# Altium project bai2.PrjPcb
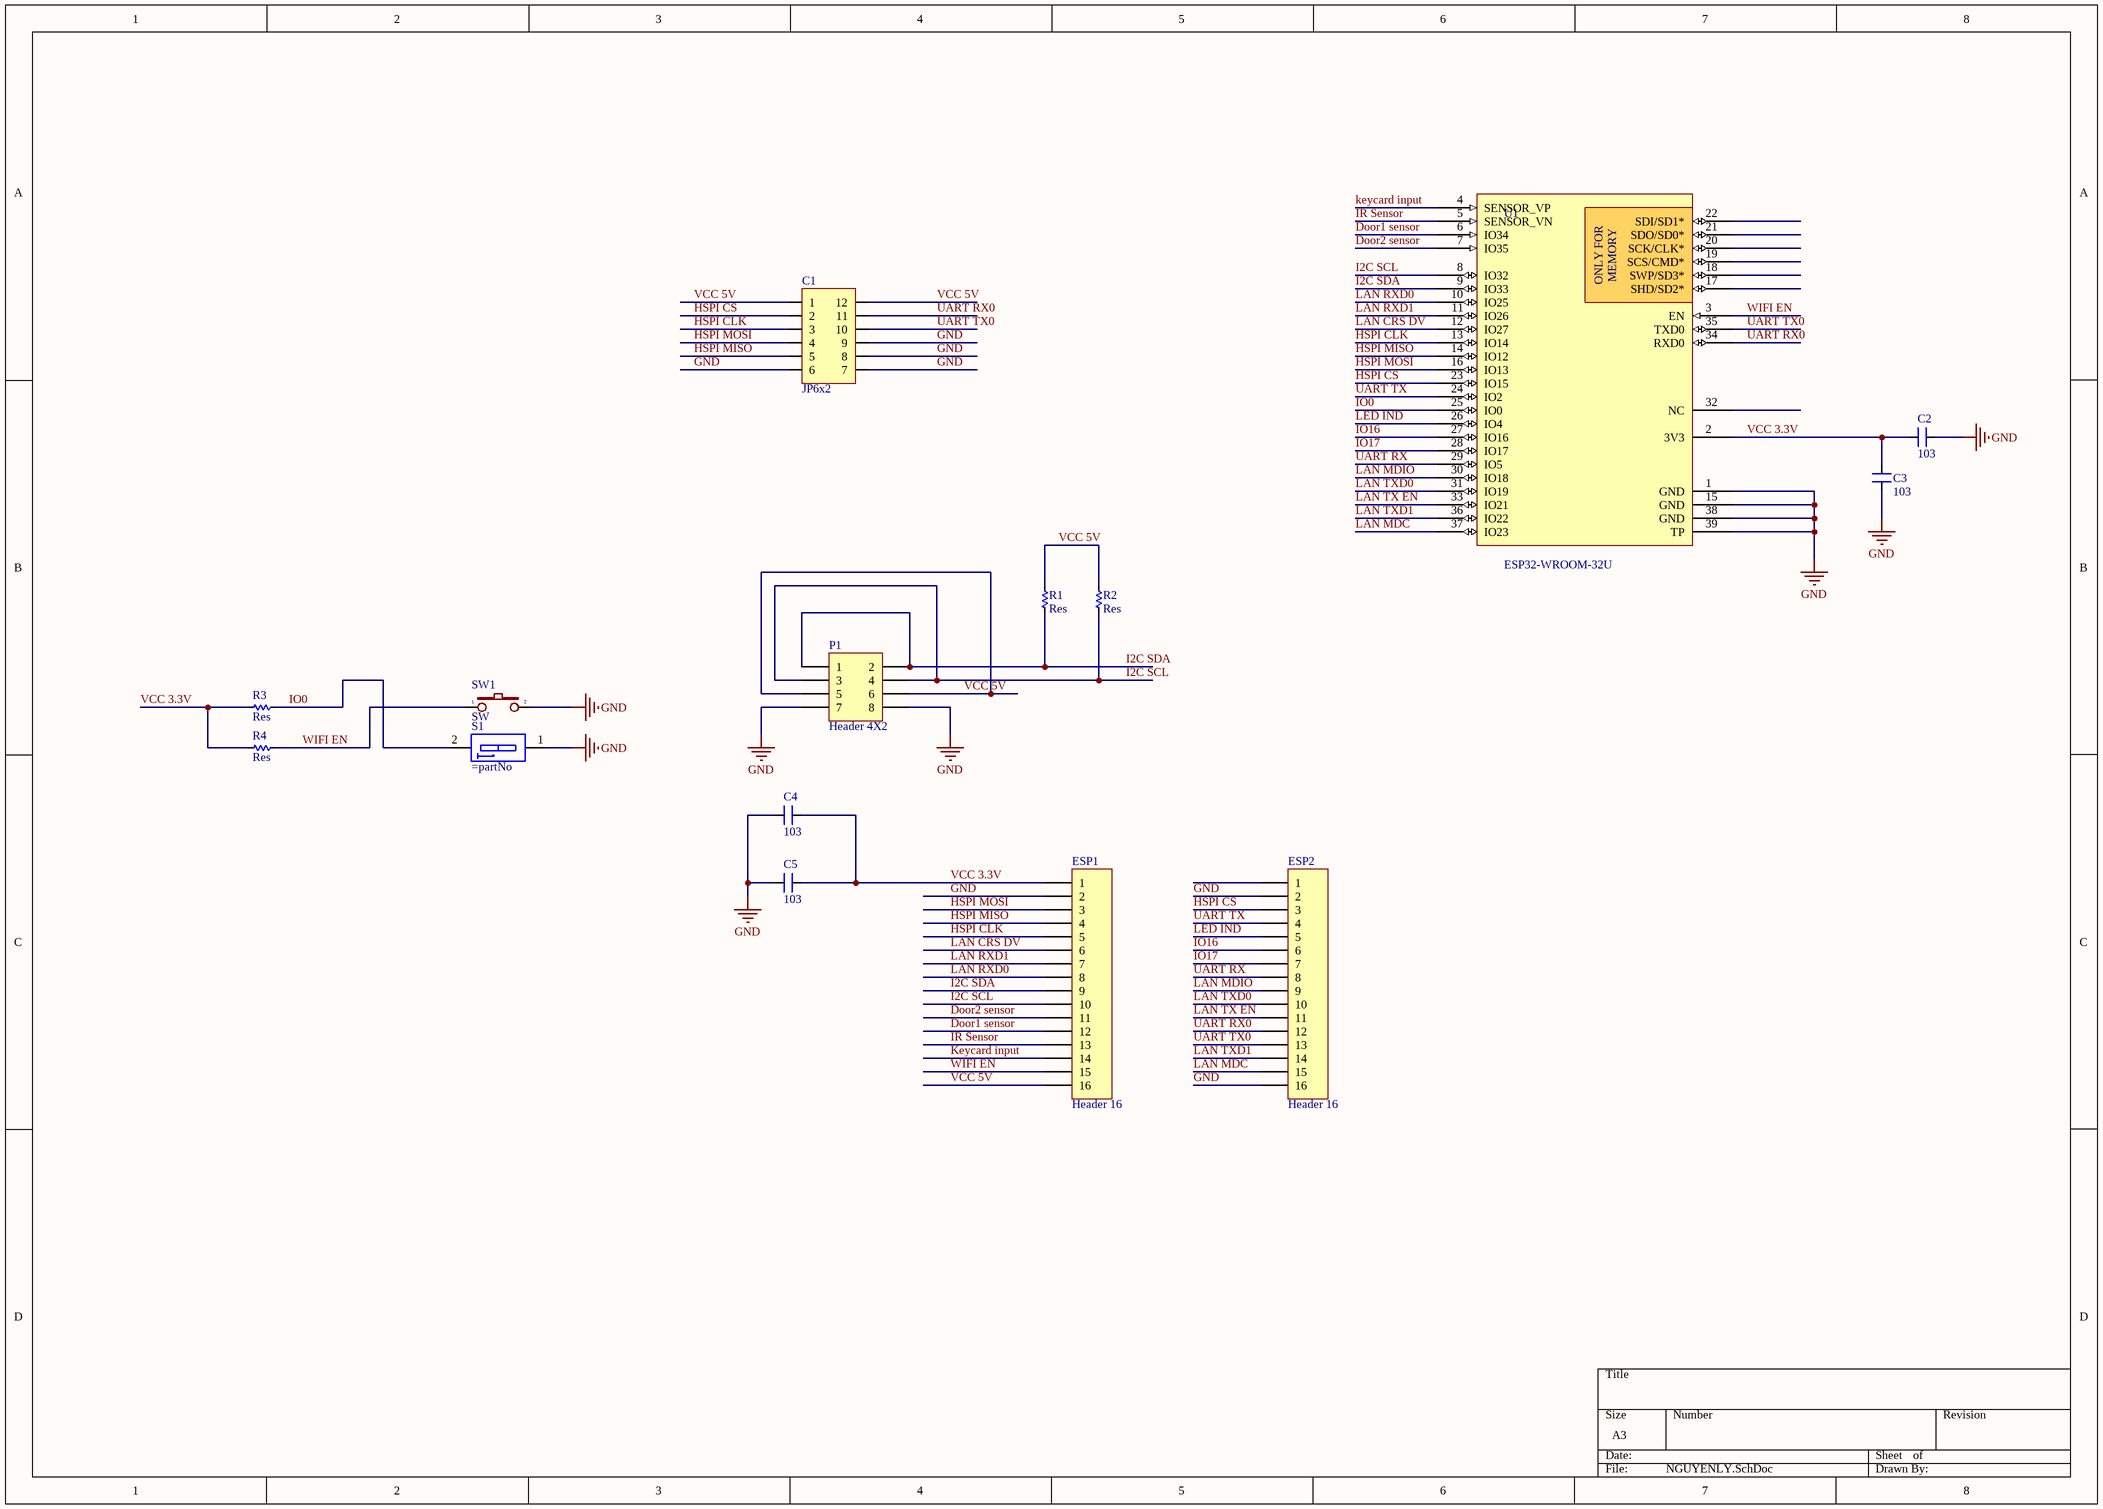
[diagram p0: NGUYENLY.SchDoc]
1 sheet, 15 parts. Net scope: global (net labels, ports and power ports of the same name join across sheets).

## Sheet NGUYENLY.SchDoc
size A3; SheetNumber: 1; SheetTotal: 1

### Parts
C1  JP6x2  [JP6-D2T]
C2  103  [SM-0805]
C3  103  [SM-0805]
C4  103  [SM-0805]
C5  103  [SM-0805]
ESP1  Header 16  [HDR1X16]
ESP2  Header 16  [HDR1X16]
P1  Header 4X2  [HDR2X4]
R1  Res  [RES-SMD-0603]
R2  Res  [RES-SMD-0603]
R3  Res  [RES-SMD-0603]
R4  Res  [RES-SMD-0603]
S1  (no value)  [SW-DIP1]
SW1  SW  [SW2]
U1  ESP32-WROOM-32U  [ESP32-WROOM-32U]

### Nets
GND: C1.6 C1.7 C1.8 C1.9 C2.2 C3.1 C4.1 C5.1 ESP1.2 ESP2.2 ESP2.16 P1.7 P1.8 S1.1 SW1.2 U1.1(GND) U1.15(GND) U1.38(GND) U1.39(TP)
Door1 sensor: ESP1.12 U1.6(IO34)
Door2 sensor: ESP1.11 U1.7(IO35)
HSPI CLK: C1.3 ESP1.5 U1.13(IO14)
HSPI CS: C1.2 ESP2.3 U1.23(IO15)
HSPI MISO: C1.5 ESP1.4 U1.14(IO12)
HSPI MOSI: C1.4 ESP1.3 U1.16(IO13)
I2C SCL: ESP1.10 P1.3 P1.4 R2.2 U1.8(IO32)
I2C SDA: ESP1.9 P1.1 P1.2 R1.2 U1.9(IO33)
IO0: R3.2 S1.2 U1.25(IO0)
IO16: ESP2.6 U1.27(IO16)
IO17: ESP2.7 U1.28(IO17)
IR Sensor: ESP1.13 U1.5(SENSOR_VN)
keycard input: ESP1.14 U1.4(SENSOR_VP)
LAN CRS DV: ESP1.6 U1.12(IO27)
LAN MDC: ESP2.15 U1.37(IO23)
LAN MDIO: ESP2.9 U1.30(IO18)
LAN RXD0: ESP1.8 U1.10(IO25)
LAN RXD1: ESP1.7 U1.11(IO26)
LAN TX EN: ESP2.11 U1.33(IO21)
LAN TXD0: ESP2.10 U1.31(IO19)
LAN TXD1: ESP2.14 U1.36(IO22)
LED IND: ESP2.5 U1.26(IO4)
UART RX: ESP2.8 U1.29(IO5)
UART RX0: C1.11 ESP2.12 U1.34(RXD0)
UART TX: ESP2.4 U1.24(IO2)
UART TX0: C1.10 ESP2.13 U1.35(TXD0)
VCC 3.3V: C2.1 C3.2 C4.2 C5.2 ESP1.1 R3.1 R4.1 U1.2(3V3)
VCC 5V: C1.1 C1.12 ESP1.16 P1.5 P1.6 R1.1 R2.1
WIFI EN: ESP1.15 R4.2 SW1.1 U1.3(EN)

Not connected (* = marked no-connect by the designer): ESP2 1; U1 17(SHD/SD2*) 18(SWP/SD3*) 19(SCS/CMD*) 20(SCK/CLK*) 21(SDO/SD0*) 22(SDI/SD1*) 32(NC)

### Notes on the sheet
- (in symbol ESP32-WROOM-32U) ONLY FOR; MEMORY

### Library data of the parts
C1 = JP6x2: WR-PHD 2.54 mm Dual Socket Header; Manufacturer: W¨¹rth Elektronik eiSos GmbH; partNo: 61301221821; ComponentLink1 Description: Manufacturer; ComponentLink2 Description: Datasheet; NoPins: 12; Created Date: 29 March 2013; ComponentLink1URL: http://www.we-online.com; ComponentLink2URL: http://katalog.we-online.de/em/datasheet/6130xx21821.pdf; Created by: Karrer Zheng
C2-C5 = CM: Cap SMD; Value: 103
ESP1 ESP2 = Header 16: Header, 16-Pin; LatestRevisionDate: 17-Jul-2002; LatestRevisionNote: Re-released for DXP Platform.; Publisher: Altium Limited
P1 = Header 4X2: Header, 4-Pin, Dual row; LatestRevisionDate: 17-Jul-2002; LatestRevisionNote: Re-released for DXP Platform.; Publisher: Altium Limited
R1-R4 = Res-SMD: Resistor; Manufacturer: Generic Components; Class: Passive; Published: 08/06/2000; Publisher: Altium Hobart Technology Centre
S1 = SWDIP1: WS-DITV 2.54 mm small compact THT flat actuator with top tape; Manufacturer: Wurth Elektronik; Part No.: 418127160901; ComponentLink1 Description: Manufacturer; ComponentLink2 Description: Datasheet; Pole: 01; Created Date: Dec.2015; ComponentLink1URL: http://www.we-online.com; ComponentLink2URL: http://katalog.we-online.de/em/datasheet/4181271609xx.pdf; Created by: Baojun Chen
SW1 = SW2: Switch button 2 pin; Value: SW chip 2 pin
U1 = ESP32-WROOM-32U: Wi-Fi/BT BLE Module ESP32-D0WD; MFR: Espressif; Solder: SMT; Price: None; Value: ESP32-WROOM-32U; Category: MODULE; MPN: ESP32-WROOM-32U; PinCount: 40